# Altium schematic sheet Tree.SchDoc: LOGIC STAGE
size 431 x 279 mm; Date: 3/1/25; CheckedBy: Liong Ma; Author: Liong Ma; CompanyName: N/A; DrawnBy: Liong Ma; Engineer: Liong Ma; DocumentNumber: 2; Revision: 1; SheetNumber: 1; SheetTotal: 9; ENG_APP_DATE: --/--/--; DSN_APP_DATE: --/--/--; CHK_APP_DATE: --/--/--
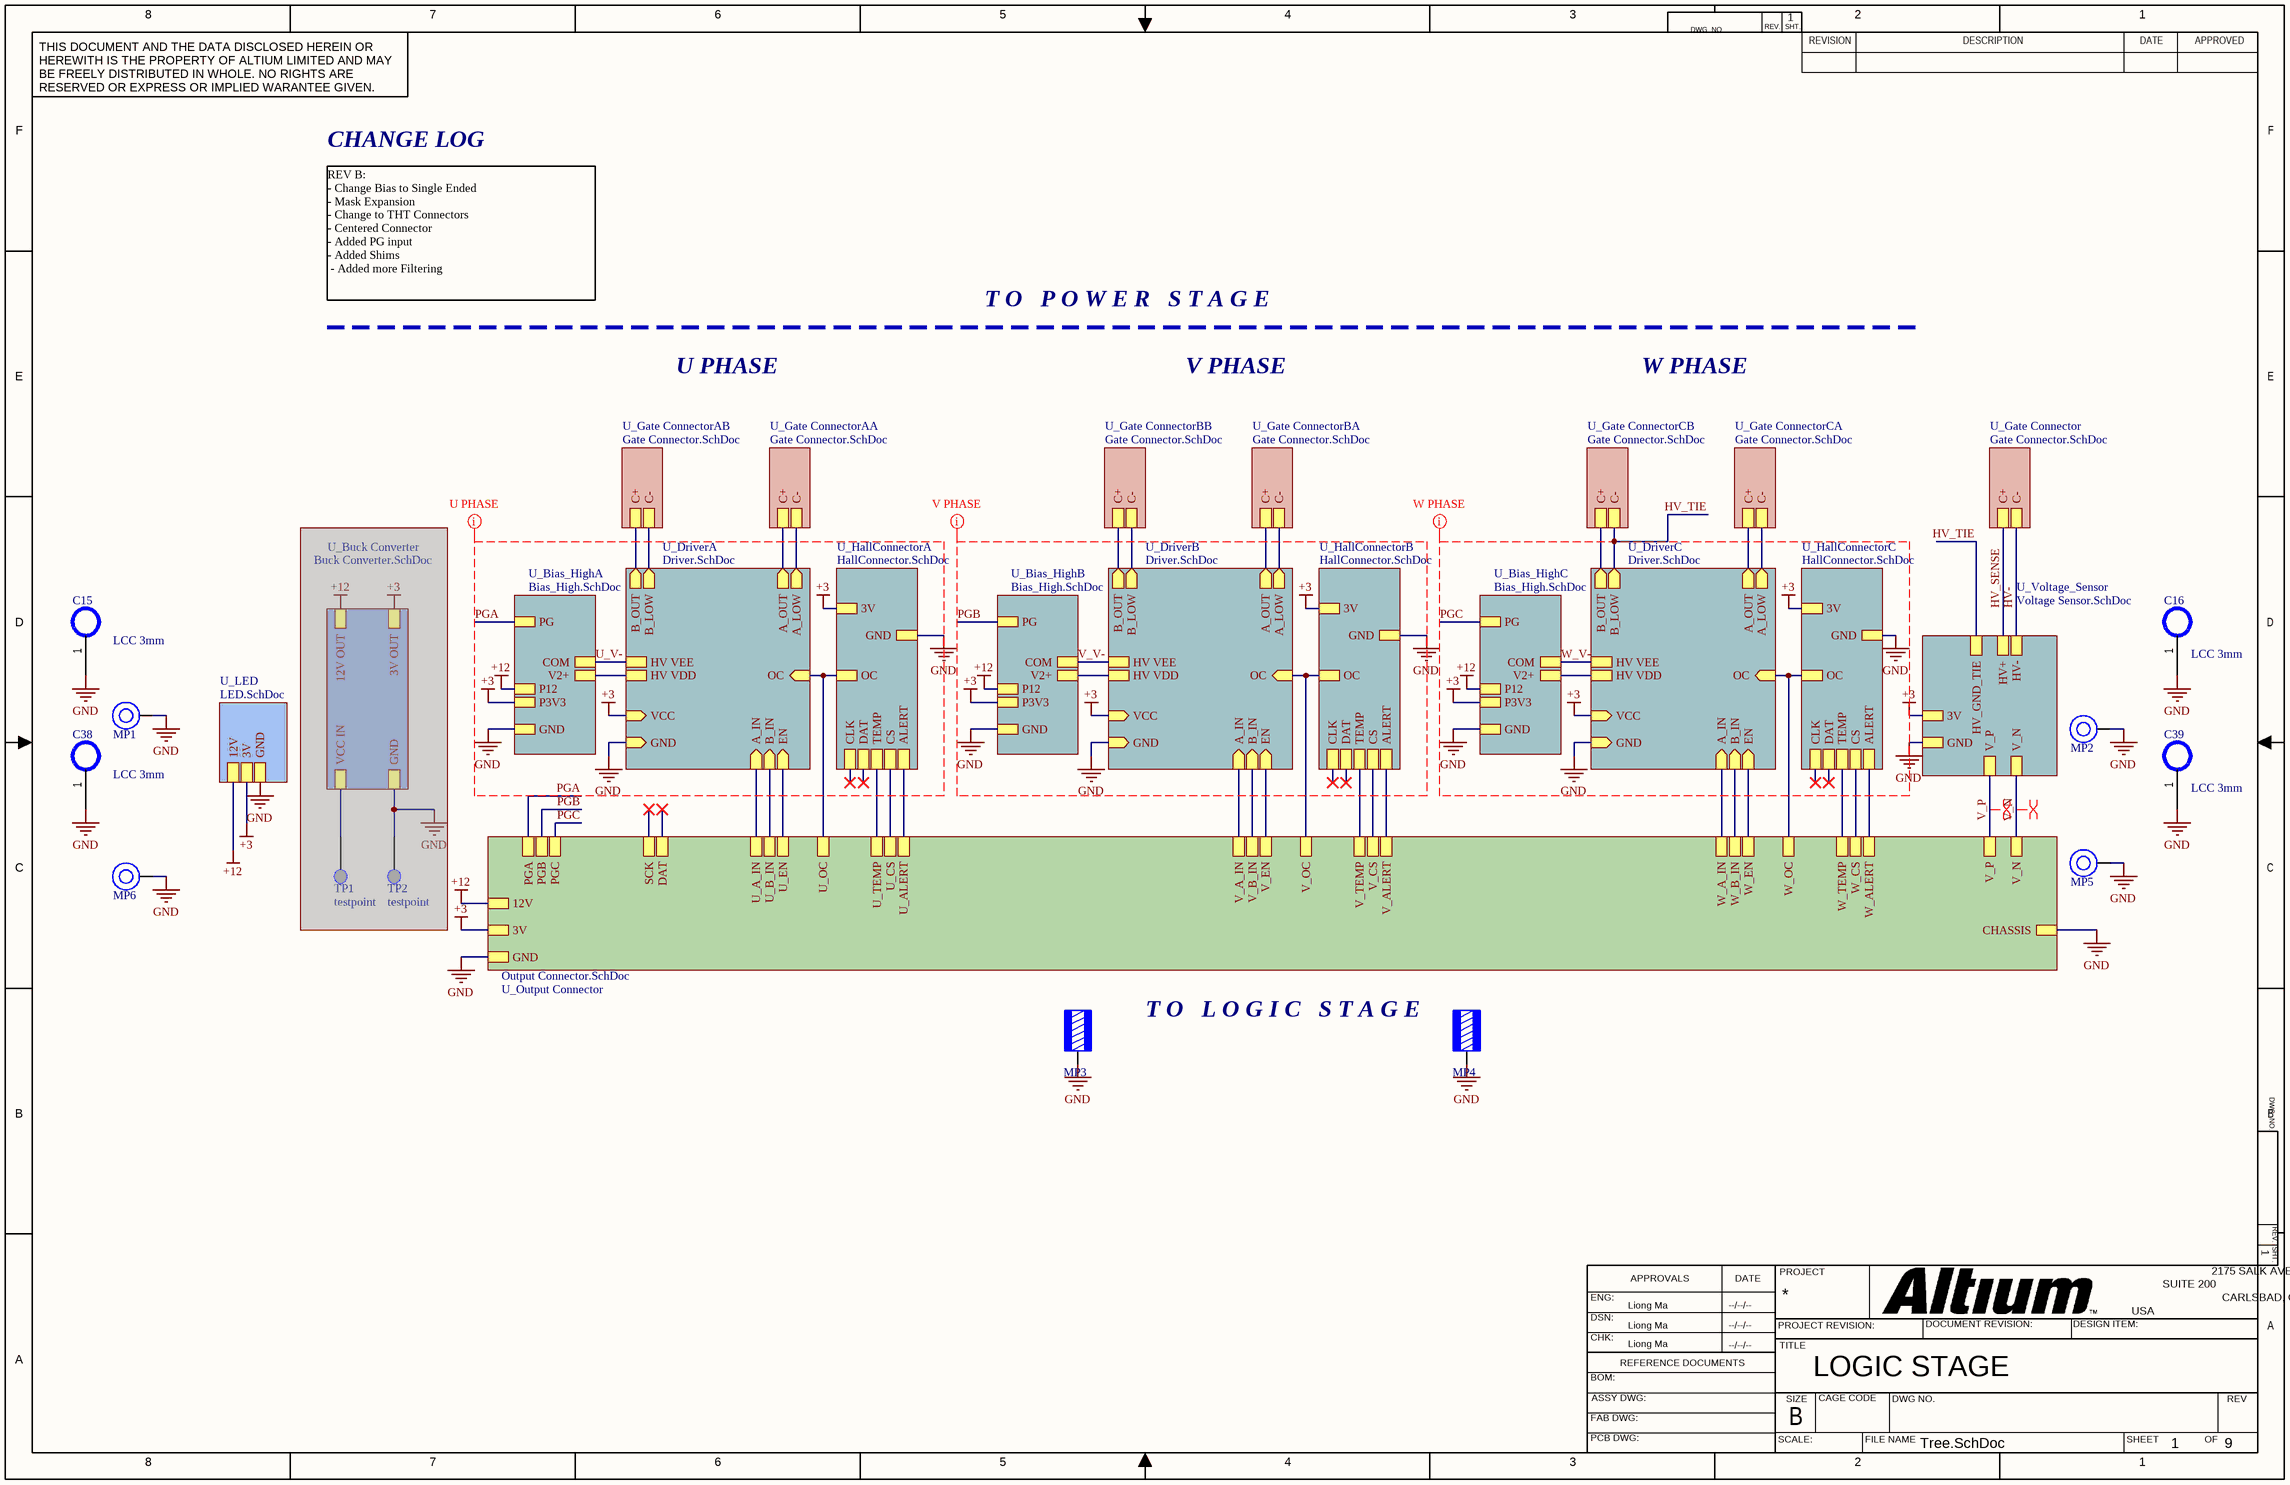
[diagram p0: Tree.SchDoc]

## Parts
C15  LCC 3mm  [PAD 3MM - duplicate]
C16  LCC 3mm  [PAD 3MM - duplicate]
C38  LCC 3mm  [PAD 3MM - duplicate]
C39  LCC 3mm  [PAD 3MM - duplicate]
MP1  M3 x 6.6mm  [9775066360]  (value not drawn)
MP2  M3 x 6.6mm  [9775066360]  (value not drawn)
MP3  M3  [7466313]  (value not drawn)
MP4  M3  [7466313]  (value not drawn)
MP5  M3 x 2.6mm  [9775026360]  (value not drawn)
MP6  M3 x 2.6mm  [9775026360]  (value not drawn)
TP1  testpoint  [testpoint-hook-0805]  (masked out: inside a compile mask, not in the netlist)
TP2  testpoint  [testpoint-hook-0805]  (masked out: inside a compile mask, not in the netlist)

## Sub-sheets
U_Bias_HighA = Bias_High.SchDoc: P12, P3V3, V2+, COM, PG, GND
U_Bias_HighB = Bias_High.SchDoc: P12, P3V3, V2+, COM, PG, GND
U_Bias_HighC = Bias_High.SchDoc: P12, P3V3, V2+, COM, PG, GND
U_Buck Converter = Buck Converter.SchDoc (masked out): VCC IN, GND, 12V OUT, 3V OUT
U_DriverA = Driver.SchDoc: B_OUT (out), B_LOW (out), EN (in), OC (in), A_OUT (out), A_LOW (out), A_IN (in), B_IN (in), VCC (in), GND (in), HV VEE, HV VDD
U_DriverB = Driver.SchDoc: B_OUT (out), B_LOW (out), EN (in), OC (in), A_OUT (out), A_LOW (out), A_IN (in), B_IN (in), VCC (in), GND (in), HV VEE, HV VDD
U_DriverC = Driver.SchDoc: B_OUT (out), B_LOW (out), EN (in), OC (in), A_OUT (out), A_LOW (out), A_IN (in), B_IN (in), VCC (in), GND (in), HV VEE, HV VDD
U_Gate Connector = Gate Connector.SchDoc: C-, C+
U_Gate ConnectorAA = Gate Connector.SchDoc: C-, C+
U_Gate ConnectorAB = Gate Connector.SchDoc: C-, C+
U_Gate ConnectorBA = Gate Connector.SchDoc: C-, C+
U_Gate ConnectorBB = Gate Connector.SchDoc: C-, C+
U_Gate ConnectorCA = Gate Connector.SchDoc: C-, C+
U_Gate ConnectorCB = Gate Connector.SchDoc: C-, C+
U_HallConnectorA = HallConnector.SchDoc: CLK, DAT, CS, 3V, OC, ALERT, GND, TEMP
U_HallConnectorB = HallConnector.SchDoc: CLK, DAT, CS, 3V, OC, ALERT, GND, TEMP
U_HallConnectorC = HallConnector.SchDoc: CLK, DAT, CS, 3V, OC, ALERT, GND, TEMP
U_LED = LED.SchDoc: 12V, 3V, GND
U_Output Connector = Output Connector.SchDoc: U_CS, U_ALERT, U_OC, U_A_IN, U_B_IN, SCK, DAT, 3V, 12V, GND, U_EN, V_CS, V_ALERT, V_OC, V_A_IN, V_B_IN, V_EN, W_CS, W_ALERT, W_OC, W_A_IN, W_B_IN, W_EN, V_P, V_N, CHASSIS, W_TEMP, V_TEMP, U_TEMP, PGA, PGB, PGC
U_Voltage_Sensor = Voltage Sensor.SchDoc: V_P, V_N, HV+, HV-, 3V, GND, HV_GND_TIE

## Nets
+3: sheet U_DriverA/VCC, sheet U_Bias_HighA/P3V3, sheet U_HallConnectorA/3V, sheet U_Output Connector/3V, sheet U_DriverB/VCC, sheet U_Bias_HighB/P3V3, sheet U_HallConnectorB/3V, sheet U_DriverC/VCC, sheet U_Bias_HighC/P3V3, sheet U_HallConnectorC/3V, sheet U_Voltage_Sensor/3V, sheet U_LED/3V
+12: sheet U_Bias_HighA/P12, sheet U_Output Connector/12V, sheet U_Bias_HighB/P12, sheet U_Bias_HighC/P12, sheet U_LED/12V
GND: C15.1 C16.1 C38.1 C39.1 MP1.1 MP2.1 MP3.1 MP4.1 MP5.1 MP6.1 ; sheet U_DriverA/GND, sheet U_Bias_HighA/GND, sheet U_HallConnectorA/GND, sheet U_Output Connector/GND, sheet U_Output Connector/CHASSIS, sheet U_DriverB/GND, sheet U_Bias_HighB/GND, sheet U_HallConnectorB/GND, sheet U_DriverC/GND, sheet U_Bias_HighC/GND, sheet U_HallConnectorC/GND, sheet U_Voltage_Sensor/GND, sheet U_LED/GND
HV-: sheet U_Voltage_Sensor/HV-, sheet U_Gate Connector/C-
HV_SENSE: sheet U_Voltage_Sensor/HV+, sheet U_Gate Connector/C+
HV_TIE: sheet U_DriverC/B_LOW, sheet U_Gate ConnectorCB/C-, sheet U_Voltage_Sensor/HV_GND_TIE
PGA: sheet U_Bias_HighA/PG, sheet U_Output Connector/PGA
PGB: sheet U_Output Connector/PGB, sheet U_Bias_HighB/PG
PGC: sheet U_Output Connector/PGC, sheet U_Bias_HighC/PG
U_V-: sheet U_DriverA/HV VEE, sheet U_Bias_HighA/COM
V_N: sheet U_Output Connector/V_N, sheet U_Voltage_Sensor/V_N
V_P: sheet U_Output Connector/V_P, sheet U_Voltage_Sensor/V_P
V_V-: sheet U_DriverB/HV VEE, sheet U_Bias_HighB/COM
W_V-: sheet U_DriverC/HV VEE, sheet U_Bias_HighC/COM
(unnamed): sheet U_DriverA/B_OUT, sheet U_Gate ConnectorAB/C+
(unnamed): sheet U_DriverA/B_LOW, sheet U_Gate ConnectorAB/C-
(unnamed): sheet U_DriverA/EN, sheet U_Output Connector/U_EN
(unnamed): sheet U_DriverA/OC, sheet U_HallConnectorA/OC, sheet U_Output Connector/U_OC
(unnamed): sheet U_DriverA/A_OUT, sheet U_Gate ConnectorAA/C+
(unnamed): sheet U_DriverA/A_LOW, sheet U_Gate ConnectorAA/C-
(unnamed): sheet U_DriverA/A_IN, sheet U_Output Connector/U_A_IN
(unnamed): sheet U_DriverA/B_IN, sheet U_Output Connector/U_B_IN
(unnamed): sheet U_DriverA/HV VDD, sheet U_Bias_HighA/V2+
(unnamed): sheet U_HallConnectorA/CS, sheet U_Output Connector/U_CS
(unnamed): sheet U_HallConnectorA/ALERT, sheet U_Output Connector/U_ALERT
(unnamed): sheet U_HallConnectorA/TEMP, sheet U_Output Connector/U_TEMP
(unnamed): sheet U_Output Connector/V_CS, sheet U_HallConnectorB/CS
(unnamed): sheet U_Output Connector/V_ALERT, sheet U_HallConnectorB/ALERT
(unnamed): sheet U_Output Connector/V_OC, sheet U_DriverB/OC, sheet U_HallConnectorB/OC
(unnamed): sheet U_Output Connector/V_A_IN, sheet U_DriverB/A_IN
(unnamed): sheet U_Output Connector/V_B_IN, sheet U_DriverB/B_IN
(unnamed): sheet U_Output Connector/V_EN, sheet U_DriverB/EN
(unnamed): sheet U_Output Connector/W_CS, sheet U_HallConnectorC/CS
(unnamed): sheet U_Output Connector/W_ALERT, sheet U_HallConnectorC/ALERT
(unnamed): sheet U_Output Connector/W_OC, sheet U_DriverC/OC, sheet U_HallConnectorC/OC
(unnamed): sheet U_Output Connector/W_A_IN, sheet U_DriverC/A_IN
(unnamed): sheet U_Output Connector/W_B_IN, sheet U_DriverC/B_IN
(unnamed): sheet U_Output Connector/W_EN, sheet U_DriverC/EN
(unnamed): sheet U_Output Connector/W_TEMP, sheet U_HallConnectorC/TEMP
(unnamed): sheet U_Output Connector/V_TEMP, sheet U_HallConnectorB/TEMP
(unnamed): sheet U_DriverB/B_OUT, sheet U_Gate ConnectorBB/C+
(unnamed): sheet U_DriverB/B_LOW, sheet U_Gate ConnectorBB/C-
(unnamed): sheet U_DriverB/A_OUT, sheet U_Gate ConnectorBA/C+
(unnamed): sheet U_DriverB/A_LOW, sheet U_Gate ConnectorBA/C-
(unnamed): sheet U_DriverB/HV VDD, sheet U_Bias_HighB/V2+
(unnamed): sheet U_DriverC/B_OUT, sheet U_Gate ConnectorCB/C+
(unnamed): sheet U_DriverC/A_OUT, sheet U_Gate ConnectorCA/C+
(unnamed): sheet U_DriverC/A_LOW, sheet U_Gate ConnectorCA/C-
(unnamed): sheet U_DriverC/HV VDD, sheet U_Bias_HighC/V2+

## Layout directives
differential pair: V_N, V_P
CompClassName: U PHASE: +3, +12, GND, PGA, U_V-
CompClassName: V PHASE: +3, +12, GND, PGB, V_V-
CompClassName: W PHASE: +3, +12, GND, PGC, W_V-

## Notes on the sheet
- CHANGE LOG
- REV B:
  - Change Bias to Single Ended
  - Mask Expansion
  - Change to THT Connectors
  - Centered Connector
  - Added PG input
  - Added Shims
  - Added more Filtering
- T O   P O W E R   S T A G E
- U PHASE
- V PHASE
- W PHASE
- (near MP4) T O   L O G I C   S T A G E
- 8
- 7
- 6
- 5
- 4
- 3
- DWG. NO.
- REV.
- SHT.
- 2
- 1
- THIS DOCUMENT AND THE DATA DISCLOSED HEREIN OR HEREWITH IS THE PROPERTY OF ALTIUM LIMITED AND MAY BE FREELY DISTRIBUTED IN WHOLE. NO RIGHTS ARE RESERVED OR EXPRESS OR IMPLIED WARANTEE GIVEN.
- REVISION
- DESCRIPTION
- DATE
- APPROVED
- F
- E
- D
- C
- B
- ENG:
- APPROVALS
- PROJECT
- SUITE 200
- 2175 SALK AVENUE
- CARLSBAD, CA 92008
- A
- DSN:
- CHK:
- REFERENCE DOCUMENTS
- PROJECT REVISION:
- TITLE
- DOCUMENT REVISION:
- DESIGN ITEM:
- USA
- BOM:
- FAB DWG:
- PCB DWG:
- ASSY DWG:
- SCALE:
- SIZE
- CAGE CODE
- FILE NAME
- DWG NO.
- SHEET
- OF
- REV

## Library data of the parts
MP1 MP2 = 9775066360R: WA-SMSR SMT Steel Spacer Reverse, M3 x 6.6mm; Manufacturer: Wurth Elektronik; Inside Diameter: 4.2mm; Outside Diameter: 6mm; Surface: Tin; ComponentLink1Description: Website Link; ComponentLink1URL: https://www.we-online.com/redexpert/article/9775066360R?ad; ComponentLink2Description: Datasheet Link; ComponentLink2URL: https://www.we-online.com/redexpert/spec/9775066360R?ad; Manufacturer Part Number: 9775066360R; Category: SMT Spacers; Match Code: WA-SMSR; Mount: Surface Mount; Operating Temperature Max: 150°C; Operating Temperature Min: -55°C; Packaging: Tape and Reel; Material: Steel; Pin Length: 6.6mm; Thread Size: M3
MP3 MP4 = 7466313R: WP-SMRA REDCUBE SMT Right Angled with pins, M3, 50A; Manufacturer: Wurth Elektronik; Surface: Tin; ComponentLink1Description: Website Link; ComponentLink1URL: https://www.we-online.com/redexpert/article/7466313R?ad; ComponentLink2Description: Datasheet Link; ComponentLink2URL: https://www.we-online.com/redexpert/spec/7466313R?ad; Manufacturer Part Number: 7466313R; Category: REDCUBE SMT; Match Code: WP-SMRA; Mount: Surface Mount; Operating Temperature Max: 150°C; Operating Temperature Min: -55°C; Packaging: Tape and Reel; Height: 7mm; Material: Brass; Rated Current: 50A; Thread Size: M3
MP5 MP6 = 9775026360R: WA-SMSR SMT Steel Spacer Reverse, M3 x 2.6mm; Manufacturer: Wurth Elektronik; Inside Diameter: 4.2mm; Outside Diameter: 6mm; Surface: Tin; ComponentLink1Description: Website Link; ComponentLink1URL: https://www.we-online.com/redexpert/article/9775026360R?ad; ComponentLink2Description: Datasheet Link; ComponentLink2URL: https://www.we-online.com/redexpert/spec/9775026360R?ad; Manufacturer Part Number: 9775026360R; Category: SMT Spacers; Match Code: WA-SMSR; Mount: Surface Mount; Operating Temperature Max: 150°C; Operating Temperature Min: -55°C; Packaging: Tape and Reel; Material: Steel; Pin Length: 2.6mm; Thread Size: M3
TP1 TP2 = CMP-022-000000-1: Source: Misc-components.SchLib; Design Item ID: testpoint